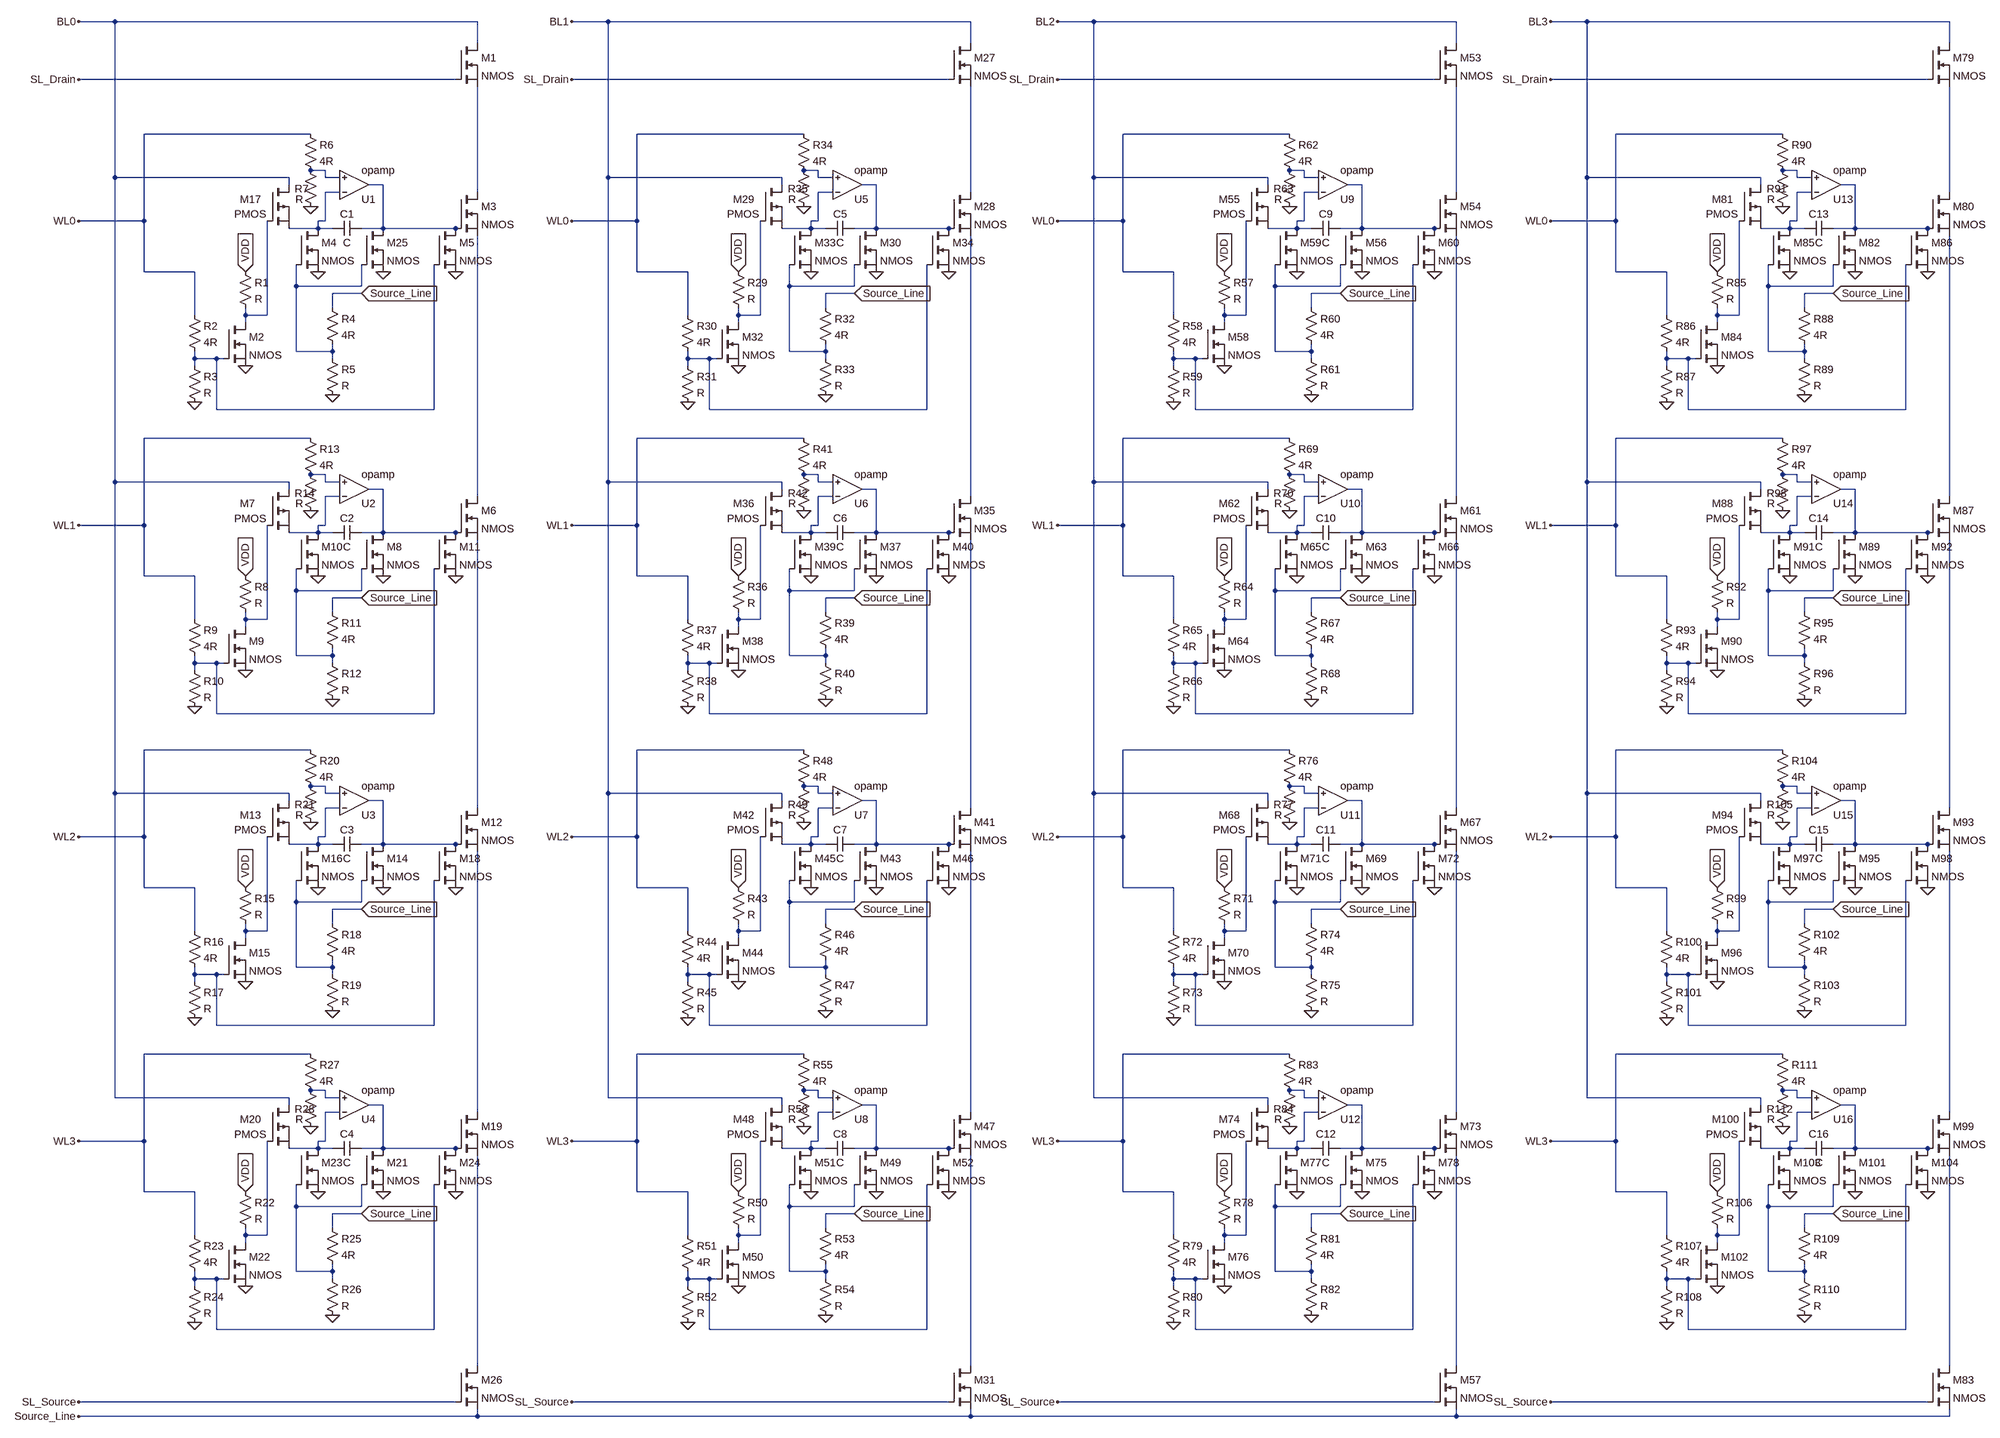
[diagram p0: schematic nand_flash_final.asc]
nand_flash_final.asc, the LTspice schematic file:
Version 4
SHEET 1 2480 2028
WIRE -2272 -1136 -2352 -1136
WIRE -1472 -1136 -2272 -1136
WIRE -1184 -1136 -1264 -1136
WIRE -384 -1136 -1184 -1136
WIRE -112 -1136 -192 -1136
WIRE 688 -1136 -112 -1136
WIRE 976 -1136 896 -1136
WIRE 1776 -1136 976 -1136
WIRE -1472 -1088 -1472 -1136
WIRE -384 -1088 -384 -1136
WIRE 688 -1088 688 -1136
WIRE 1776 -1088 1776 -1136
WIRE -1520 -1008 -2352 -1008
WIRE -432 -1008 -1264 -1008
WIRE 640 -1008 -192 -1008
WIRE 1728 -1008 896 -1008
WIRE -1840 -864 -2208 -864
WIRE -752 -864 -1120 -864
WIRE 320 -864 -48 -864
WIRE 1408 -864 1040 -864
WIRE -1808 -784 -1840 -784
WIRE -720 -784 -752 -784
WIRE 352 -784 320 -784
WIRE 1440 -784 1408 -784
WIRE -2272 -768 -2272 -1136
WIRE -1888 -768 -2272 -768
WIRE -1808 -768 -1808 -784
WIRE -1776 -768 -1808 -768
WIRE -1184 -768 -1184 -1136
WIRE -800 -768 -1184 -768
WIRE -720 -768 -720 -784
WIRE -688 -768 -720 -768
WIRE -112 -768 -112 -1136
WIRE 272 -768 -112 -768
WIRE 352 -768 352 -784
WIRE 384 -768 352 -768
WIRE 976 -768 976 -1136
WIRE 1360 -768 976 -768
WIRE 1440 -768 1440 -784
WIRE 1472 -768 1440 -768
WIRE -1888 -752 -1888 -768
WIRE -1680 -752 -1712 -752
WIRE -800 -752 -800 -768
WIRE -592 -752 -624 -752
WIRE 272 -752 272 -768
WIRE 480 -752 448 -752
WIRE 1360 -752 1360 -768
WIRE 1568 -752 1536 -752
WIRE -1776 -736 -1808 -736
WIRE -1472 -736 -1472 -992
WIRE -688 -736 -720 -736
WIRE -384 -736 -384 -992
WIRE 384 -736 352 -736
WIRE 688 -736 688 -992
WIRE 1472 -736 1440 -736
WIRE 1776 -736 1776 -992
WIRE -2208 -672 -2208 -864
WIRE -2208 -672 -2352 -672
WIRE -1808 -672 -1808 -736
WIRE -1808 -672 -1824 -672
WIRE -1120 -672 -1120 -864
WIRE -1120 -672 -1264 -672
WIRE -720 -672 -720 -736
WIRE -720 -672 -736 -672
WIRE -48 -672 -48 -864
WIRE -48 -672 -192 -672
WIRE 352 -672 352 -736
WIRE 352 -672 336 -672
WIRE 1040 -672 1040 -864
WIRE 1040 -672 896 -672
WIRE 1440 -672 1440 -736
WIRE 1440 -672 1424 -672
WIRE -1824 -656 -1824 -672
WIRE -1824 -656 -1888 -656
WIRE -1792 -656 -1824 -656
WIRE -1680 -656 -1680 -752
WIRE -1680 -656 -1728 -656
WIRE -1520 -656 -1680 -656
WIRE -736 -656 -736 -672
WIRE -736 -656 -800 -656
WIRE -704 -656 -736 -656
WIRE -592 -656 -592 -752
WIRE -592 -656 -640 -656
WIRE -432 -656 -592 -656
WIRE 336 -656 336 -672
WIRE 336 -656 272 -656
WIRE 368 -656 336 -656
WIRE 480 -656 480 -752
WIRE 480 -656 432 -656
WIRE 640 -656 480 -656
WIRE 1424 -656 1424 -672
WIRE 1424 -656 1360 -656
WIRE 1456 -656 1424 -656
WIRE 1568 -656 1568 -752
WIRE 1568 -656 1520 -656
WIRE 1728 -656 1568 -656
WIRE -2208 -560 -2208 -672
WIRE -2096 -560 -2208 -560
WIRE -1120 -560 -1120 -672
WIRE -1008 -560 -1120 -560
WIRE -48 -560 -48 -672
WIRE 64 -560 -48 -560
WIRE 1040 -560 1040 -672
WIRE 1152 -560 1040 -560
WIRE -1872 -528 -1872 -576
WIRE -1728 -528 -1728 -576
WIRE -1728 -528 -1872 -528
WIRE -784 -528 -784 -576
WIRE -640 -528 -640 -576
WIRE -640 -528 -784 -528
WIRE 288 -528 288 -576
WIRE 432 -528 432 -576
WIRE 432 -528 288 -528
WIRE 1376 -528 1376 -576
WIRE 1520 -528 1520 -576
WIRE 1520 -528 1376 -528
WIRE -1728 -512 -1792 -512
WIRE -640 -512 -704 -512
WIRE 432 -512 368 -512
WIRE 1520 -512 1456 -512
WIRE -1792 -480 -1792 -512
WIRE -704 -480 -704 -512
WIRE 368 -480 368 -512
WIRE 1456 -480 1456 -512
WIRE -2096 -464 -2096 -560
WIRE -1984 -464 -1984 -480
WIRE -1936 -464 -1936 -672
WIRE -1936 -464 -1984 -464
WIRE -1008 -464 -1008 -560
WIRE -896 -464 -896 -480
WIRE -848 -464 -848 -672
WIRE -848 -464 -896 -464
WIRE 64 -464 64 -560
WIRE 176 -464 176 -480
WIRE 224 -464 224 -672
WIRE 224 -464 176 -464
WIRE 1152 -464 1152 -560
WIRE 1264 -464 1264 -480
WIRE 1312 -464 1312 -672
WIRE 1312 -464 1264 -464
WIRE -1984 -448 -1984 -464
WIRE -896 -448 -896 -464
WIRE 176 -448 176 -464
WIRE 1264 -448 1264 -464
WIRE -1872 -384 -1872 -528
WIRE -1792 -384 -1792 -400
WIRE -1792 -384 -1872 -384
WIRE -784 -384 -784 -528
WIRE -704 -384 -704 -400
WIRE -704 -384 -784 -384
WIRE 288 -384 288 -528
WIRE 368 -384 368 -400
WIRE 368 -384 288 -384
WIRE 1376 -384 1376 -528
WIRE 1456 -384 1456 -400
WIRE 1456 -384 1376 -384
WIRE -2096 -368 -2096 -384
WIRE -2048 -368 -2096 -368
WIRE -2032 -368 -2048 -368
WIRE -1792 -368 -1792 -384
WIRE -1008 -368 -1008 -384
WIRE -960 -368 -1008 -368
WIRE -944 -368 -960 -368
WIRE -704 -368 -704 -384
WIRE 64 -368 64 -384
WIRE 112 -368 64 -368
WIRE 128 -368 112 -368
WIRE 368 -368 368 -384
WIRE 1152 -368 1152 -384
WIRE 1200 -368 1152 -368
WIRE 1216 -368 1200 -368
WIRE 1456 -368 1456 -384
WIRE -2096 -352 -2096 -368
WIRE -1008 -352 -1008 -368
WIRE 64 -352 64 -368
WIRE 1152 -352 1152 -368
WIRE -2048 -256 -2048 -368
WIRE -1568 -256 -1568 -576
WIRE -1568 -256 -2048 -256
WIRE -960 -256 -960 -368
WIRE -480 -256 -480 -576
WIRE -480 -256 -960 -256
WIRE 112 -256 112 -368
WIRE 592 -256 592 -576
WIRE 592 -256 112 -256
WIRE 1200 -256 1200 -368
WIRE 1680 -256 1680 -576
WIRE 1680 -256 1200 -256
WIRE -1840 -192 -2208 -192
WIRE -752 -192 -1120 -192
WIRE 320 -192 -48 -192
WIRE 1408 -192 1040 -192
WIRE -1808 -112 -1840 -112
WIRE -720 -112 -752 -112
WIRE 352 -112 320 -112
WIRE 1440 -112 1408 -112
WIRE -2272 -96 -2272 -768
WIRE -1888 -96 -2272 -96
WIRE -1808 -96 -1808 -112
WIRE -1776 -96 -1808 -96
WIRE -1184 -96 -1184 -768
WIRE -800 -96 -1184 -96
WIRE -720 -96 -720 -112
WIRE -688 -96 -720 -96
WIRE -112 -96 -112 -768
WIRE 272 -96 -112 -96
WIRE 352 -96 352 -112
WIRE 384 -96 352 -96
WIRE 976 -96 976 -768
WIRE 1360 -96 976 -96
WIRE 1440 -96 1440 -112
WIRE 1472 -96 1440 -96
WIRE -1888 -80 -1888 -96
WIRE -1680 -80 -1712 -80
WIRE -800 -80 -800 -96
WIRE -592 -80 -624 -80
WIRE 272 -80 272 -96
WIRE 480 -80 448 -80
WIRE 1360 -80 1360 -96
WIRE 1568 -80 1536 -80
WIRE -1776 -64 -1808 -64
WIRE -1472 -64 -1472 -640
WIRE -688 -64 -720 -64
WIRE -384 -64 -384 -640
WIRE 384 -64 352 -64
WIRE 688 -64 688 -640
WIRE 1472 -64 1440 -64
WIRE 1776 -64 1776 -640
WIRE -2208 0 -2208 -192
WIRE -2208 0 -2352 0
WIRE -1808 0 -1808 -64
WIRE -1808 0 -1824 0
WIRE -1120 0 -1120 -192
WIRE -1120 0 -1264 0
WIRE -720 0 -720 -64
WIRE -720 0 -736 0
WIRE -48 0 -48 -192
WIRE -48 0 -192 0
WIRE 352 0 352 -64
WIRE 352 0 336 0
WIRE 1040 0 1040 -192
WIRE 1040 0 896 0
WIRE 1440 0 1440 -64
WIRE 1440 0 1424 0
WIRE -1824 16 -1824 0
WIRE -1824 16 -1888 16
WIRE -1792 16 -1824 16
WIRE -1680 16 -1680 -80
WIRE -1680 16 -1728 16
WIRE -1520 16 -1680 16
WIRE -736 16 -736 0
WIRE -736 16 -800 16
WIRE -704 16 -736 16
WIRE -592 16 -592 -80
WIRE -592 16 -640 16
WIRE -432 16 -592 16
WIRE 336 16 336 0
WIRE 336 16 272 16
WIRE 368 16 336 16
WIRE 480 16 480 -80
WIRE 480 16 432 16
WIRE 640 16 480 16
WIRE 1424 16 1424 0
WIRE 1424 16 1360 16
WIRE 1456 16 1424 16
WIRE 1568 16 1568 -80
WIRE 1568 16 1520 16
WIRE 1728 16 1568 16
WIRE -2208 112 -2208 0
WIRE -2096 112 -2208 112
WIRE -1120 112 -1120 0
WIRE -1008 112 -1120 112
WIRE -48 112 -48 0
WIRE 64 112 -48 112
WIRE 1040 112 1040 0
WIRE 1152 112 1040 112
WIRE -1872 144 -1872 96
WIRE -1728 144 -1728 96
WIRE -1728 144 -1872 144
WIRE -784 144 -784 96
WIRE -640 144 -640 96
WIRE -640 144 -784 144
WIRE 288 144 288 96
WIRE 432 144 432 96
WIRE 432 144 288 144
WIRE 1376 144 1376 96
WIRE 1520 144 1520 96
WIRE 1520 144 1376 144
WIRE -1728 160 -1792 160
WIRE -640 160 -704 160
WIRE 432 160 368 160
WIRE 1520 160 1456 160
WIRE -1792 192 -1792 160
WIRE -704 192 -704 160
WIRE 368 192 368 160
WIRE 1456 192 1456 160
WIRE -2096 208 -2096 112
WIRE -1984 208 -1984 192
WIRE -1936 208 -1936 0
WIRE -1936 208 -1984 208
WIRE -1008 208 -1008 112
WIRE -896 208 -896 192
WIRE -848 208 -848 0
WIRE -848 208 -896 208
WIRE 64 208 64 112
WIRE 176 208 176 192
WIRE 224 208 224 0
WIRE 224 208 176 208
WIRE 1152 208 1152 112
WIRE 1264 208 1264 192
WIRE 1312 208 1312 0
WIRE 1312 208 1264 208
WIRE -1984 224 -1984 208
WIRE -896 224 -896 208
WIRE 176 224 176 208
WIRE 1264 224 1264 208
WIRE -1872 288 -1872 144
WIRE -1792 288 -1792 272
WIRE -1792 288 -1872 288
WIRE -784 288 -784 144
WIRE -704 288 -704 272
WIRE -704 288 -784 288
WIRE 288 288 288 144
WIRE 368 288 368 272
WIRE 368 288 288 288
WIRE 1376 288 1376 144
WIRE 1456 288 1456 272
WIRE 1456 288 1376 288
WIRE -2096 304 -2096 288
WIRE -2048 304 -2096 304
WIRE -2032 304 -2048 304
WIRE -1792 304 -1792 288
WIRE -1008 304 -1008 288
WIRE -960 304 -1008 304
WIRE -944 304 -960 304
WIRE -704 304 -704 288
WIRE 64 304 64 288
WIRE 112 304 64 304
WIRE 128 304 112 304
WIRE 368 304 368 288
WIRE 1152 304 1152 288
WIRE 1200 304 1152 304
WIRE 1216 304 1200 304
WIRE 1456 304 1456 288
WIRE -2096 320 -2096 304
WIRE -1008 320 -1008 304
WIRE 64 320 64 304
WIRE 1152 320 1152 304
WIRE -2048 416 -2048 304
WIRE -1568 416 -1568 96
WIRE -1568 416 -2048 416
WIRE -960 416 -960 304
WIRE -480 416 -480 96
WIRE -480 416 -960 416
WIRE 112 416 112 304
WIRE 592 416 592 96
WIRE 592 416 112 416
WIRE 1200 416 1200 304
WIRE 1680 416 1680 96
WIRE 1680 416 1200 416
WIRE -1840 496 -2208 496
WIRE -752 496 -1120 496
WIRE 320 496 -48 496
WIRE 1408 496 1040 496
WIRE -1808 576 -1840 576
WIRE -720 576 -752 576
WIRE 352 576 320 576
WIRE 1440 576 1408 576
WIRE -2272 592 -2272 -96
WIRE -1888 592 -2272 592
WIRE -1808 592 -1808 576
WIRE -1776 592 -1808 592
WIRE -1184 592 -1184 -96
WIRE -800 592 -1184 592
WIRE -720 592 -720 576
WIRE -688 592 -720 592
WIRE -112 592 -112 -96
WIRE 272 592 -112 592
WIRE 352 592 352 576
WIRE 384 592 352 592
WIRE 976 592 976 -96
WIRE 1360 592 976 592
WIRE 1440 592 1440 576
WIRE 1472 592 1440 592
WIRE -1888 608 -1888 592
WIRE -1680 608 -1712 608
WIRE -800 608 -800 592
WIRE -592 608 -624 608
WIRE 272 608 272 592
WIRE 480 608 448 608
WIRE 1360 608 1360 592
WIRE 1568 608 1536 608
WIRE -1776 624 -1808 624
WIRE -1472 624 -1472 32
WIRE -688 624 -720 624
WIRE -384 624 -384 32
WIRE 384 624 352 624
WIRE 688 624 688 32
WIRE 1472 624 1440 624
WIRE 1776 624 1776 32
WIRE -2208 688 -2208 496
WIRE -2208 688 -2352 688
WIRE -1808 688 -1808 624
WIRE -1808 688 -1824 688
WIRE -1120 688 -1120 496
WIRE -1120 688 -1264 688
WIRE -720 688 -720 624
WIRE -720 688 -736 688
WIRE -48 688 -48 496
WIRE -48 688 -192 688
WIRE 352 688 352 624
WIRE 352 688 336 688
WIRE 1040 688 1040 496
WIRE 1040 688 896 688
WIRE 1440 688 1440 624
WIRE 1440 688 1424 688
WIRE -1824 704 -1824 688
WIRE -1824 704 -1888 704
WIRE -1792 704 -1824 704
WIRE -1680 704 -1680 608
WIRE -1680 704 -1728 704
WIRE -1520 704 -1680 704
WIRE -736 704 -736 688
WIRE -736 704 -800 704
WIRE -704 704 -736 704
WIRE -592 704 -592 608
WIRE -592 704 -640 704
WIRE -432 704 -592 704
WIRE 336 704 336 688
WIRE 336 704 272 704
WIRE 368 704 336 704
WIRE 480 704 480 608
WIRE 480 704 432 704
WIRE 640 704 480 704
WIRE 1424 704 1424 688
WIRE 1424 704 1360 704
WIRE 1456 704 1424 704
WIRE 1568 704 1568 608
WIRE 1568 704 1520 704
WIRE 1728 704 1568 704
WIRE -2208 800 -2208 688
WIRE -2096 800 -2208 800
WIRE -1120 800 -1120 688
WIRE -1008 800 -1120 800
WIRE -48 800 -48 688
WIRE 64 800 -48 800
WIRE 1040 800 1040 688
WIRE 1152 800 1040 800
WIRE -1872 832 -1872 784
WIRE -1728 832 -1728 784
WIRE -1728 832 -1872 832
WIRE -784 832 -784 784
WIRE -640 832 -640 784
WIRE -640 832 -784 832
WIRE 288 832 288 784
WIRE 432 832 432 784
WIRE 432 832 288 832
WIRE 1376 832 1376 784
WIRE 1520 832 1520 784
WIRE 1520 832 1376 832
WIRE -1728 848 -1792 848
WIRE -640 848 -704 848
WIRE 432 848 368 848
WIRE 1520 848 1456 848
WIRE -1792 880 -1792 848
WIRE -704 880 -704 848
WIRE 368 880 368 848
WIRE 1456 880 1456 848
WIRE -2096 896 -2096 800
WIRE -1984 896 -1984 880
WIRE -1936 896 -1936 688
WIRE -1936 896 -1984 896
WIRE -1008 896 -1008 800
WIRE -896 896 -896 880
WIRE -848 896 -848 688
WIRE -848 896 -896 896
WIRE 64 896 64 800
WIRE 176 896 176 880
WIRE 224 896 224 688
WIRE 224 896 176 896
WIRE 1152 896 1152 800
WIRE 1264 896 1264 880
WIRE 1312 896 1312 688
WIRE 1312 896 1264 896
WIRE -1984 912 -1984 896
WIRE -896 912 -896 896
WIRE 176 912 176 896
WIRE 1264 912 1264 896
WIRE -1872 976 -1872 832
WIRE -1792 976 -1792 960
WIRE -1792 976 -1872 976
WIRE -784 976 -784 832
WIRE -704 976 -704 960
WIRE -704 976 -784 976
WIRE 288 976 288 832
WIRE 368 976 368 960
WIRE 368 976 288 976
WIRE 1376 976 1376 832
WIRE 1456 976 1456 960
WIRE 1456 976 1376 976
WIRE -2096 992 -2096 976
WIRE -2048 992 -2096 992
WIRE -2032 992 -2048 992
WIRE -1792 992 -1792 976
WIRE -1008 992 -1008 976
WIRE -960 992 -1008 992
WIRE -944 992 -960 992
WIRE -704 992 -704 976
WIRE 64 992 64 976
WIRE 112 992 64 992
WIRE 128 992 112 992
WIRE 368 992 368 976
WIRE 1152 992 1152 976
WIRE 1200 992 1152 992
WIRE 1216 992 1200 992
WIRE 1456 992 1456 976
WIRE -2096 1008 -2096 992
WIRE -1008 1008 -1008 992
WIRE 64 1008 64 992
WIRE 1152 1008 1152 992
WIRE -2048 1104 -2048 992
WIRE -1568 1104 -1568 784
WIRE -1568 1104 -2048 1104
WIRE -960 1104 -960 992
WIRE -480 1104 -480 784
WIRE -480 1104 -960 1104
WIRE 112 1104 112 992
WIRE 592 1104 592 784
WIRE 592 1104 112 1104
WIRE 1200 1104 1200 992
WIRE 1680 1104 1680 784
WIRE 1680 1104 1200 1104
WIRE -1840 1168 -2208 1168
WIRE -752 1168 -1120 1168
WIRE 320 1168 -48 1168
WIRE 1408 1168 1040 1168
WIRE -1808 1248 -1840 1248
WIRE -720 1248 -752 1248
WIRE 352 1248 320 1248
WIRE 1440 1248 1408 1248
WIRE -2272 1264 -2272 592
WIRE -1888 1264 -2272 1264
WIRE -1808 1264 -1808 1248
WIRE -1776 1264 -1808 1264
WIRE -1184 1264 -1184 592
WIRE -800 1264 -1184 1264
WIRE -720 1264 -720 1248
WIRE -688 1264 -720 1264
WIRE -112 1264 -112 592
WIRE 272 1264 -112 1264
WIRE 352 1264 352 1248
WIRE 384 1264 352 1264
WIRE 976 1264 976 592
WIRE 1360 1264 976 1264
WIRE 1440 1264 1440 1248
WIRE 1472 1264 1440 1264
WIRE -1888 1280 -1888 1264
WIRE -1680 1280 -1712 1280
WIRE -800 1280 -800 1264
WIRE -592 1280 -624 1280
WIRE 272 1280 272 1264
WIRE 480 1280 448 1280
WIRE 1360 1280 1360 1264
WIRE 1568 1280 1536 1280
WIRE -1776 1296 -1808 1296
WIRE -1472 1296 -1472 720
WIRE -688 1296 -720 1296
WIRE -384 1296 -384 720
WIRE 384 1296 352 1296
WIRE 688 1296 688 720
WIRE 1472 1296 1440 1296
WIRE 1776 1296 1776 720
WIRE -2208 1360 -2208 1168
WIRE -2208 1360 -2352 1360
WIRE -1808 1360 -1808 1296
WIRE -1808 1360 -1824 1360
WIRE -1120 1360 -1120 1168
WIRE -1120 1360 -1264 1360
WIRE -720 1360 -720 1296
WIRE -720 1360 -736 1360
WIRE -48 1360 -48 1168
WIRE -48 1360 -192 1360
WIRE 352 1360 352 1296
WIRE 352 1360 336 1360
WIRE 1040 1360 1040 1168
WIRE 1040 1360 896 1360
WIRE 1440 1360 1440 1296
WIRE 1440 1360 1424 1360
WIRE -1824 1376 -1824 1360
WIRE -1824 1376 -1888 1376
WIRE -1792 1376 -1824 1376
WIRE -1680 1376 -1680 1280
WIRE -1680 1376 -1728 1376
WIRE -1520 1376 -1680 1376
WIRE -736 1376 -736 1360
WIRE -736 1376 -800 1376
WIRE -704 1376 -736 1376
WIRE -592 1376 -592 1280
WIRE -592 1376 -640 1376
WIRE -432 1376 -592 1376
WIRE 336 1376 336 1360
WIRE 336 1376 272 1376
WIRE 368 1376 336 1376
WIRE 480 1376 480 1280
WIRE 480 1376 432 1376
WIRE 640 1376 480 1376
WIRE 1424 1376 1424 1360
WIRE 1424 1376 1360 1376
WIRE 1456 1376 1424 1376
WIRE 1568 1376 1568 1280
WIRE 1568 1376 1520 1376
WIRE 1728 1376 1568 1376
WIRE -2208 1472 -2208 1360
WIRE -2096 1472 -2208 1472
WIRE -1120 1472 -1120 1360
WIRE -1008 1472 -1120 1472
WIRE -48 1472 -48 1360
WIRE 64 1472 -48 1472
WIRE 1040 1472 1040 1360
WIRE 1152 1472 1040 1472
WIRE -1872 1504 -1872 1456
WIRE -1728 1504 -1728 1456
WIRE -1728 1504 -1872 1504
WIRE -784 1504 -784 1456
WIRE -640 1504 -640 1456
WIRE -640 1504 -784 1504
WIRE 288 1504 288 1456
WIRE 432 1504 432 1456
WIRE 432 1504 288 1504
WIRE 1376 1504 1376 1456
WIRE 1520 1504 1520 1456
WIRE 1520 1504 1376 1504
WIRE -1728 1520 -1792 1520
WIRE -640 1520 -704 1520
WIRE 432 1520 368 1520
WIRE 1520 1520 1456 1520
WIRE -1792 1552 -1792 1520
WIRE -704 1552 -704 1520
WIRE 368 1552 368 1520
WIRE 1456 1552 1456 1520
WIRE -2096 1568 -2096 1472
WIRE -1984 1568 -1984 1552
WIRE -1936 1568 -1936 1360
WIRE -1936 1568 -1984 1568
WIRE -1008 1568 -1008 1472
WIRE -896 1568 -896 1552
WIRE -848 1568 -848 1360
WIRE -848 1568 -896 1568
WIRE 64 1568 64 1472
WIRE 176 1568 176 1552
WIRE 224 1568 224 1360
WIRE 224 1568 176 1568
WIRE 1152 1568 1152 1472
WIRE 1264 1568 1264 1552
WIRE 1312 1568 1312 1360
WIRE 1312 1568 1264 1568
WIRE -1984 1584 -1984 1568
WIRE -896 1584 -896 1568
WIRE 176 1584 176 1568
WIRE 1264 1584 1264 1568
WIRE -1872 1648 -1872 1504
WIRE -1792 1648 -1792 1632
WIRE -1792 1648 -1872 1648
WIRE -784 1648 -784 1504
WIRE -704 1648 -704 1632
WIRE -704 1648 -784 1648
WIRE 288 1648 288 1504
WIRE 368 1648 368 1632
WIRE 368 1648 288 1648
WIRE 1376 1648 1376 1504
WIRE 1456 1648 1456 1632
WIRE 1456 1648 1376 1648
WIRE -2096 1664 -2096 1648
WIRE -2048 1664 -2096 1664
WIRE -2032 1664 -2048 1664
WIRE -1792 1664 -1792 1648
WIRE -1008 1664 -1008 1648
WIRE -960 1664 -1008 1664
WIRE -944 1664 -960 1664
WIRE -704 1664 -704 1648
WIRE 64 1664 64 1648
WIRE 112 1664 64 1664
WIRE 128 1664 112 1664
WIRE 368 1664 368 1648
WIRE 1152 1664 1152 1648
WIRE 1200 1664 1152 1664
WIRE 1216 1664 1200 1664
WIRE 1456 1664 1456 1648
WIRE -2096 1680 -2096 1664
WIRE -1008 1680 -1008 1664
WIRE 64 1680 64 1664
WIRE 1152 1680 1152 1664
WIRE -2048 1776 -2048 1664
WIRE -1568 1776 -1568 1456
WIRE -1568 1776 -2048 1776
WIRE -960 1776 -960 1664
WIRE -480 1776 -480 1456
WIRE -480 1776 -960 1776
WIRE 112 1776 112 1664
WIRE 592 1776 592 1456
WIRE 592 1776 112 1776
WIRE 1200 1776 1200 1664
WIRE 1680 1776 1680 1456
WIRE 1680 1776 1200 1776
WIRE -1472 1856 -1472 1392
WIRE -384 1856 -384 1392
WIRE 688 1856 688 1392
WIRE 1776 1856 1776 1392
WIRE -1520 1936 -2352 1936
WIRE -432 1936 -1264 1936
WIRE 640 1936 -192 1936
WIRE 1728 1936 896 1936
WIRE -1472 1968 -1472 1952
WIRE -1472 1968 -2352 1968
WIRE -384 1968 -384 1952
WIRE -384 1968 -1472 1968
WIRE 688 1968 688 1952
WIRE 688 1968 -384 1968
WIRE 1776 1968 1776 1952
WIRE 1776 1968 688 1968
FLAG -1680 -560 0
FLAG -1984 -560 VDD
IOPIN -1984 -560 In
FLAG -1984 -352 0
FLAG -2096 -272 0
FLAG -1824 -560 0
FLAG -1792 -288 0
FLAG -1840 -704 0
FLAG -1520 -560 0
FLAG -2352 -1136 BL0
FLAG -2352 -672 WL0
FLAG -2352 -1008 SL_Drain
FLAG -2352 1936 SL_Source
FLAG -2352 1968 Source_Line
FLAG -1728 -512 Source_Line
IOPIN -1728 -512 In
FLAG -1680 112 0
FLAG -1984 112 VDD
IOPIN -1984 112 In
FLAG -1984 320 0
FLAG -2096 400 0
FLAG -1824 112 0
FLAG -1792 384 0
FLAG -1840 -32 0
FLAG -1520 112 0
FLAG -2352 0 WL1
FLAG -1728 160 Source_Line
IOPIN -1728 160 In
FLAG -1680 800 0
FLAG -1984 800 VDD
IOPIN -1984 800 In
FLAG -1984 1008 0
FLAG -2096 1088 0
FLAG -1824 800 0
FLAG -1792 1072 0
FLAG -1840 656 0
FLAG -1520 800 0
FLAG -2352 688 WL2
FLAG -1728 848 Source_Line
IOPIN -1728 848 In
FLAG -1680 1472 0
FLAG -1984 1472 VDD
IOPIN -1984 1472 In
FLAG -1984 1680 0
FLAG -2096 1760 0
FLAG -1824 1472 0
FLAG -1792 1744 0
FLAG -1840 1328 0
FLAG -1520 1472 0
FLAG -2352 1360 WL3
FLAG -1728 1520 Source_Line
IOPIN -1728 1520 In
FLAG -592 -560 0
FLAG -896 -560 VDD
IOPIN -896 -560 In
FLAG -896 -352 0
FLAG -1008 -272 0
FLAG -736 -560 0
FLAG -704 -288 0
FLAG -752 -704 0
FLAG -432 -560 0
FLAG -1264 -1136 BL1
FLAG -1264 -672 WL0
FLAG -1264 -1008 SL_Drain
FLAG -1264 1936 SL_Source
FLAG -640 -512 Source_Line
IOPIN -640 -512 In
FLAG -592 112 0
FLAG -896 112 VDD
IOPIN -896 112 In
FLAG -896 320 0
FLAG -1008 400 0
FLAG -736 112 0
FLAG -704 384 0
FLAG -752 -32 0
FLAG -432 112 0
FLAG -1264 0 WL1
FLAG -640 160 Source_Line
IOPIN -640 160 In
FLAG -592 800 0
FLAG -896 800 VDD
IOPIN -896 800 In
FLAG -896 1008 0
FLAG -1008 1088 0
FLAG -736 800 0
FLAG -704 1072 0
FLAG -752 656 0
FLAG -432 800 0
FLAG -1264 688 WL2
FLAG -640 848 Source_Line
IOPIN -640 848 In
FLAG -592 1472 0
FLAG -896 1472 VDD
IOPIN -896 1472 In
FLAG -896 1680 0
FLAG -1008 1760 0
FLAG -736 1472 0
FLAG -704 1744 0
FLAG -752 1328 0
FLAG -432 1472 0
FLAG -1264 1360 WL3
FLAG -640 1520 Source_Line
IOPIN -640 1520 In
FLAG 480 -560 0
FLAG 176 -560 VDD
IOPIN 176 -560 In
FLAG 176 -352 0
FLAG 64 -272 0
FLAG 336 -560 0
FLAG 368 -288 0
FLAG 320 -704 0
FLAG 640 -560 0
FLAG -192 -1136 BL2
FLAG -192 -672 WL0
FLAG -192 -1008 SL_Drain
FLAG -192 1936 SL_Source
FLAG 432 -512 Source_Line
IOPIN 432 -512 In
FLAG 480 112 0
FLAG 176 112 VDD
IOPIN 176 112 In
FLAG 176 320 0
FLAG 64 400 0
FLAG 336 112 0
FLAG 368 384 0
FLAG 320 -32 0
FLAG 640 112 0
FLAG -192 0 WL1
FLAG 432 160 Source_Line
IOPIN 432 160 In
FLAG 480 800 0
FLAG 176 800 VDD
IOPIN 176 800 In
FLAG 176 1008 0
FLAG 64 1088 0
FLAG 336 800 0
FLAG 368 1072 0
FLAG 320 656 0
FLAG 640 800 0
FLAG -192 688 WL2
FLAG 432 848 Source_Line
IOPIN 432 848 In
FLAG 480 1472 0
FLAG 176 1472 VDD
IOPIN 176 1472 In
FLAG 176 1680 0
FLAG 64 1760 0
FLAG 336 1472 0
FLAG 368 1744 0
FLAG 320 1328 0
FLAG 640 1472 0
FLAG -192 1360 WL3
FLAG 432 1520 Source_Line
IOPIN 432 1520 In
FLAG 1568 -560 0
FLAG 1264 -560 VDD
IOPIN 1264 -560 In
FLAG 1264 -352 0
FLAG 1152 -272 0
FLAG 1424 -560 0
FLAG 1456 -288 0
FLAG 1408 -704 0
FLAG 1728 -560 0
FLAG 896 -1136 BL3
FLAG 896 -672 WL0
FLAG 896 -1008 SL_Drain
FLAG 896 1936 SL_Source
FLAG 1520 -512 Source_Line
IOPIN 1520 -512 In
FLAG 1568 112 0
FLAG 1264 112 VDD
IOPIN 1264 112 In
FLAG 1264 320 0
FLAG 1152 400 0
FLAG 1424 112 0
FLAG 1456 384 0
FLAG 1408 -32 0
FLAG 1728 112 0
FLAG 896 0 WL1
FLAG 1520 160 Source_Line
IOPIN 1520 160 In
FLAG 1568 800 0
FLAG 1264 800 VDD
IOPIN 1264 800 In
FLAG 1264 1008 0
FLAG 1152 1088 0
FLAG 1424 800 0
FLAG 1456 1072 0
FLAG 1408 656 0
FLAG 1728 800 0
FLAG 896 688 WL2
FLAG 1520 848 Source_Line
IOPIN 1520 848 In
FLAG 1568 1472 0
FLAG 1264 1472 VDD
IOPIN 1264 1472 In
FLAG 1264 1680 0
FLAG 1152 1760 0
FLAG 1424 1472 0
FLAG 1456 1744 0
FLAG 1408 1328 0
FLAG 1728 1472 0
FLAG 896 1360 WL3
FLAG 1520 1520 Source_Line
IOPIN 1520 1520 In
SYMBOL nmos -1520 -1088 R0
SYMATTR InstName M1
SYMBOL nmos -1520 -736 R0
SYMATTR InstName M3
SYMBOL cap -1728 -672 R90
WINDOW 0 0 32 VBottom 2
WINDOW 3 32 32 VTop 2
SYMATTR InstName C1
SYMBOL pmos -1936 -752 R0
WINDOW 0 -60 32 Left 2
WINDOW 3 -73 65 Left 2
SYMATTR InstName M17
SYMBOL nmos -1728 -656 R0
SYMATTR InstName M25
SYMBOL nmos -1520 1856 R0
SYMATTR InstName M26
SYMBOL res -2000 -576 R0
SYMATTR InstName R1
SYMBOL nmos -2032 -448 R0
SYMATTR InstName M2
SYMBOL res -2112 -480 R0
SYMATTR InstName R2
SYMATTR Value 4R
SYMBOL res -2112 -368 R0
SYMATTR InstName R3
SYMBOL nmos -1872 -656 R0
SYMATTR InstName M4
SYMBOL res -1808 -496 R0
SYMATTR InstName R4
SYMATTR Value 4R
SYMBOL res -1808 -384 R0
SYMATTR InstName R5
SYMBOL OpAmps\\opamp -1744 -688 M180
SYMATTR InstName U1
SYMBOL res -1856 -880 R0
SYMATTR InstName R6
SYMATTR Value 4R
SYMBOL res -1856 -800 R0
WINDOW 0 -19 57 Left 2
WINDOW 3 -18 80 Left 2
SYMATTR InstName R7
SYMBOL nmos -1568 -656 R0
SYMATTR InstName M5
SYMBOL nmos -1520 -64 R0
SYMATTR InstName M6
SYMBOL cap -1728 0 R90
WINDOW 0 0 32 VBottom 2
WINDOW 3 32 32 VTop 2
SYMATTR InstName C2
SYMBOL pmos -1936 -80 R0
WINDOW 0 -60 32 Left 2
WINDOW 3 -73 65 Left 2
SYMATTR InstName M7
SYMBOL nmos -1728 16 R0
SYMATTR InstName M8
SYMBOL res -2000 96 R0
SYMATTR InstName R8
SYMBOL nmos -2032 224 R0
SYMATTR InstName M9
SYMBOL res -2112 192 R0
SYMATTR InstName R9
SYMATTR Value 4R
SYMBOL res -2112 304 R0
SYMATTR InstName R10
SYMBOL nmos -1872 16 R0
SYMATTR InstName M10
SYMBOL res -1808 176 R0
SYMATTR InstName R11
SYMATTR Value 4R
SYMBOL res -1808 288 R0
SYMATTR InstName R12
SYMBOL OpAmps\\opamp -1744 -16 M180
SYMATTR InstName U2
SYMBOL res -1856 -208 R0
SYMATTR InstName R13
SYMATTR Value 4R
SYMBOL res -1856 -128 R0
WINDOW 0 -19 57 Left 2
WINDOW 3 -18 80 Left 2
SYMATTR InstName R14
SYMBOL nmos -1568 16 R0
SYMATTR InstName M11
SYMBOL nmos -1520 624 R0
SYMATTR InstName M12
SYMBOL cap -1728 688 R90
WINDOW 0 0 32 VBottom 2
WINDOW 3 32 32 VTop 2
SYMATTR InstName C3
SYMBOL pmos -1936 608 R0
WINDOW 0 -60 32 Left 2
WINDOW 3 -73 65 Left 2
SYMATTR InstName M13
SYMBOL nmos -1728 704 R0
SYMATTR InstName M14
SYMBOL res -2000 784 R0
SYMATTR InstName R15
SYMBOL nmos -2032 912 R0
SYMATTR InstName M15
SYMBOL res -2112 880 R0
SYMATTR InstName R16
SYMATTR Value 4R
SYMBOL res -2112 992 R0
SYMATTR InstName R17
SYMBOL nmos -1872 704 R0
SYMATTR InstName M16
SYMBOL res -1808 864 R0
SYMATTR InstName R18
SYMATTR Value 4R
SYMBOL res -1808 976 R0
SYMATTR InstName R19
SYMBOL OpAmps\\opamp -1744 672 M180
SYMATTR InstName U3
SYMBOL res -1856 480 R0
SYMATTR InstName R20
SYMATTR Value 4R
SYMBOL res -1856 560 R0
WINDOW 0 -19 57 Left 2
WINDOW 3 -18 80 Left 2
SYMATTR InstName R21
SYMBOL nmos -1568 704 R0
SYMATTR InstName M18
SYMBOL nmos -1520 1296 R0
SYMATTR InstName M19
SYMBOL cap -1728 1360 R90
WINDOW 0 0 32 VBottom 2
WINDOW 3 32 32 VTop 2
SYMATTR InstName C4
SYMBOL pmos -1936 1280 R0
WINDOW 0 -60 32 Left 2
WINDOW 3 -73 65 Left 2
SYMATTR InstName M20
SYMBOL nmos -1728 1376 R0
SYMATTR InstName M21
SYMBOL res -2000 1456 R0
SYMATTR InstName R22
SYMBOL nmos -2032 1584 R0
SYMATTR InstName M22
SYMBOL res -2112 1552 R0
SYMATTR InstName R23
SYMATTR Value 4R
SYMBOL res -2112 1664 R0
SYMATTR InstName R24
SYMBOL nmos -1872 1376 R0
SYMATTR InstName M23
SYMBOL res -1808 1536 R0
SYMATTR InstName R25
SYMATTR Value 4R
SYMBOL res -1808 1648 R0
SYMATTR InstName R26
SYMBOL OpAmps\\opamp -1744 1344 M180
SYMATTR InstName U4
SYMBOL res -1856 1152 R0
SYMATTR InstName R27
SYMATTR Value 4R
SYMBOL res -1856 1232 R0
WINDOW 0 -19 57 Left 2
WINDOW 3 -18 80 Left 2
SYMATTR InstName R28
SYMBOL nmos -1568 1376 R0
SYMATTR InstName M24
SYMBOL nmos -432 -1088 R0
SYMATTR InstName M27
SYMBOL nmos -432 -736 R0
SYMATTR InstName M28
SYMBOL cap -640 -672 R90
WINDOW 0 0 32 VBottom 2
WINDOW 3 32 32 VTop 2
SYMATTR InstName C5
SYMBOL pmos -848 -752 R0
WINDOW 0 -60 32 Left 2
WINDOW 3 -73 65 Left 2
SYMATTR InstName M29
SYMBOL nmos -640 -656 R0
SYMATTR InstName M30
SYMBOL nmos -432 1856 R0
SYMATTR InstName M31
SYMBOL res -912 -576 R0
SYMATTR InstName R29
SYMBOL nmos -944 -448 R0
SYMATTR InstName M32
SYMBOL res -1024 -480 R0
SYMATTR InstName R30
SYMATTR Value 4R
SYMBOL res -1024 -368 R0
SYMATTR InstName R31
SYMBOL nmos -784 -656 R0
SYMATTR InstName M33
SYMBOL res -720 -496 R0
SYMATTR InstName R32
SYMATTR Value 4R
SYMBOL res -720 -384 R0
SYMATTR InstName R33
SYMBOL OpAmps\\opamp -656 -688 M180
SYMATTR InstName U5
SYMBOL res -768 -880 R0
SYMATTR InstName R34
SYMATTR Value 4R
SYMBOL res -768 -800 R0
WINDOW 0 -19 57 Left 2
WINDOW 3 -18 80 Left 2
SYMATTR InstName R35
SYMBOL nmos -480 -656 R0
SYMATTR InstName M34
SYMBOL nmos -432 -64 R0
SYMATTR InstName M35
SYMBOL cap -640 0 R90
WINDOW 0 0 32 VBottom 2
WINDOW 3 32 32 VTop 2
SYMATTR InstName C6
SYMBOL pmos -848 -80 R0
WINDOW 0 -60 32 Left 2
WINDOW 3 -73 65 Left 2
SYMATTR InstName M36
SYMBOL nmos -640 16 R0
SYMATTR InstName M37
SYMBOL res -912 96 R0
SYMATTR InstName R36
SYMBOL nmos -944 224 R0
SYMATTR InstName M38
SYMBOL res -1024 192 R0
SYMATTR InstName R37
SYMATTR Value 4R
SYMBOL res -1024 304 R0
SYMATTR InstName R38
SYMBOL nmos -784 16 R0
SYMATTR InstName M39
SYMBOL res -720 176 R0
SYMATTR InstName R39
SYMATTR Value 4R
SYMBOL res -720 288 R0
SYMATTR InstName R40
SYMBOL OpAmps\\opamp -656 -16 M180
SYMATTR InstName U6
SYMBOL res -768 -208 R0
SYMATTR InstName R41
SYMATTR Value 4R
SYMBOL res -768 -128 R0
WINDOW 0 -19 57 Left 2
WINDOW 3 -18 80 Left 2
SYMATTR InstName R42
SYMBOL nmos -480 16 R0
SYMATTR InstName M40
SYMBOL nmos -432 624 R0
SYMATTR InstName M41
SYMBOL cap -640 688 R90
WINDOW 0 0 32 VBottom 2
WINDOW 3 32 32 VTop 2
SYMATTR InstName C7
SYMBOL pmos -848 608 R0
WINDOW 0 -60 32 Left 2
WINDOW 3 -73 65 Left 2
SYMATTR InstName M42
SYMBOL nmos -640 704 R0
SYMATTR InstName M43
SYMBOL res -912 784 R0
SYMATTR InstName R43
SYMBOL nmos -944 912 R0
SYMATTR InstName M44
SYMBOL res -1024 880 R0
SYMATTR InstName R44
SYMATTR Value 4R
SYMBOL res -1024 992 R0
SYMATTR InstName R45
SYMBOL nmos -784 704 R0
SYMATTR InstName M45
SYMBOL res -720 864 R0
SYMATTR InstName R46
SYMATTR Value 4R
SYMBOL res -720 976 R0
SYMATTR InstName R47
SYMBOL OpAmps\\opamp -656 672 M180
SYMATTR InstName U7
SYMBOL res -768 480 R0
SYMATTR InstName R48
SYMATTR Value 4R
SYMBOL res -768 560 R0
WINDOW 0 -19 57 Left 2
WINDOW 3 -18 80 Left 2
SYMATTR InstName R49
SYMBOL nmos -480 704 R0
SYMATTR InstName M46
SYMBOL nmos -432 1296 R0
SYMATTR InstName M47
SYMBOL cap -640 1360 R90
WINDOW 0 0 32 VBottom 2
WINDOW 3 32 32 VTop 2
SYMATTR InstName C8
SYMBOL pmos -848 1280 R0
WINDOW 0 -60 32 Left 2
WINDOW 3 -73 65 Left 2
SYMATTR InstName M48
SYMBOL nmos -640 1376 R0
SYMATTR InstName M49
SYMBOL res -912 1456 R0
SYMATTR InstName R50
SYMBOL nmos -944 1584 R0
SYMATTR InstName M50
SYMBOL res -1024 1552 R0
SYMATTR InstName R51
SYMATTR Value 4R
SYMBOL res -1024 1664 R0
SYMATTR InstName R52
SYMBOL nmos -784 1376 R0
SYMATTR InstName M51
SYMBOL res -720 1536 R0
SYMATTR InstName R53
SYMATTR Value 4R
SYMBOL res -720 1648 R0
SYMATTR InstName R54
SYMBOL OpAmps\\opamp -656 1344 M180
SYMATTR InstName U8
SYMBOL res -768 1152 R0
SYMATTR InstName R55
SYMATTR Value 4R
SYMBOL res -768 1232 R0
WINDOW 0 -19 57 Left 2
WINDOW 3 -18 80 Left 2
SYMATTR InstName R56
SYMBOL nmos -480 1376 R0
SYMATTR InstName M52
SYMBOL nmos 640 -1088 R0
SYMATTR InstName M53
SYMBOL nmos 640 -736 R0
SYMATTR InstName M54
SYMBOL cap 432 -672 R90
WINDOW 0 0 32 VBottom 2
WINDOW 3 32 32 VTop 2
SYMATTR InstName C9
SYMBOL pmos 224 -752 R0
WINDOW 0 -60 32 Left 2
WINDOW 3 -73 65 Left 2
SYMATTR InstName M55
SYMBOL nmos 432 -656 R0
SYMATTR InstName M56
SYMBOL nmos 640 1856 R0
SYMATTR InstName M57
SYMBOL res 160 -576 R0
SYMATTR InstName R57
SYMBOL nmos 128 -448 R0
SYMATTR InstName M58
SYMBOL res 48 -480 R0
SYMATTR InstName R58
SYMATTR Value 4R
SYMBOL res 48 -368 R0
SYMATTR InstName R59
SYMBOL nmos 288 -656 R0
SYMATTR InstName M59
SYMBOL res 352 -496 R0
SYMATTR InstName R60
SYMATTR Value 4R
SYMBOL res 352 -384 R0
SYMATTR InstName R61
SYMBOL OpAmps\\opamp 416 -688 M180
SYMATTR InstName U9
SYMBOL res 304 -880 R0
SYMATTR InstName R62
SYMATTR Value 4R
SYMBOL res 304 -800 R0
WINDOW 0 -19 57 Left 2
WINDOW 3 -18 80 Left 2
SYMATTR InstName R63
SYMBOL nmos 592 -656 R0
SYMATTR InstName M60
SYMBOL nmos 640 -64 R0
SYMATTR InstName M61
SYMBOL cap 432 0 R90
WINDOW 0 0 32 VBottom 2
WINDOW 3 32 32 VTop 2
SYMATTR InstName C10
SYMBOL pmos 224 -80 R0
WINDOW 0 -60 32 Left 2
WINDOW 3 -73 65 Left 2
SYMATTR InstName M62
SYMBOL nmos 432 16 R0
SYMATTR InstName M63
SYMBOL res 160 96 R0
SYMATTR InstName R64
SYMBOL nmos 128 224 R0
SYMATTR InstName M64
SYMBOL res 48 192 R0
SYMATTR InstName R65
SYMATTR Value 4R
SYMBOL res 48 304 R0
SYMATTR InstName R66
SYMBOL nmos 288 16 R0
SYMATTR InstName M65
SYMBOL res 352 176 R0
SYMATTR InstName R67
SYMATTR Value 4R
SYMBOL res 352 288 R0
SYMATTR InstName R68
SYMBOL OpAmps\\opamp 416 -16 M180
SYMATTR InstName U10
SYMBOL res 304 -208 R0
SYMATTR InstName R69
SYMATTR Value 4R
SYMBOL res 304 -128 R0
WINDOW 0 -19 57 Left 2
WINDOW 3 -18 80 Left 2
SYMATTR InstName R70
SYMBOL nmos 592 16 R0
SYMATTR InstName M66
SYMBOL nmos 640 624 R0
SYMATTR InstName M67
SYMBOL cap 432 688 R90
WINDOW 0 0 32 VBottom 2
WINDOW 3 32 32 VTop 2
SYMATTR InstName C11
SYMBOL pmos 224 608 R0
WINDOW 0 -60 32 Left 2
WINDOW 3 -73 65 Left 2
SYMATTR InstName M68
SYMBOL nmos 432 704 R0
SYMATTR InstName M69
SYMBOL res 160 784 R0
SYMATTR InstName R71
SYMBOL nmos 128 912 R0
SYMATTR InstName M70
SYMBOL res 48 880 R0
SYMATTR InstName R72
SYMATTR Value 4R
SYMBOL res 48 992 R0
SYMATTR InstName R73
SYMBOL nmos 288 704 R0
SYMATTR InstName M71
SYMBOL res 352 864 R0
SYMATTR InstName R74
SYMATTR Value 4R
SYMBOL res 352 976 R0
SYMATTR InstName R75
SYMBOL OpAmps\\opamp 416 672 M180
SYMATTR InstName U11
SYMBOL res 304 480 R0
SYMATTR InstName R76
SYMATTR Value 4R
SYMBOL res 304 560 R0
WINDOW 0 -19 57 Left 2
WINDOW 3 -18 80 Left 2
SYMATTR InstName R77
SYMBOL nmos 592 704 R0
SYMATTR InstName M72
SYMBOL nmos 640 1296 R0
SYMATTR InstName M73
SYMBOL cap 432 1360 R90
WINDOW 0 0 32 VBottom 2
WINDOW 3 32 32 VTop 2
SYMATTR InstName C12
SYMBOL pmos 224 1280 R0
WINDOW 0 -60 32 Left 2
WINDOW 3 -73 65 Left 2
SYMATTR InstName M74
SYMBOL nmos 432 1376 R0
SYMATTR InstName M75
SYMBOL res 160 1456 R0
SYMATTR InstName R78
SYMBOL nmos 128 1584 R0
SYMATTR InstName M76
SYMBOL res 48 1552 R0
SYMATTR InstName R79
SYMATTR Value 4R
SYMBOL res 48 1664 R0
SYMATTR InstName R80
SYMBOL nmos 288 1376 R0
SYMATTR InstName M77
SYMBOL res 352 1536 R0
SYMATTR InstName R81
SYMATTR Value 4R
SYMBOL res 352 1648 R0
SYMATTR InstName R82
SYMBOL OpAmps\\opamp 416 1344 M180
SYMATTR InstName U12
SYMBOL res 304 1152 R0
SYMATTR InstName R83
SYMATTR Value 4R
SYMBOL res 304 1232 R0
WINDOW 0 -19 57 Left 2
WINDOW 3 -18 80 Left 2
SYMATTR InstName R84
SYMBOL nmos 592 1376 R0
SYMATTR InstName M78
SYMBOL nmos 1728 -1088 R0
SYMATTR InstName M79
SYMBOL nmos 1728 -736 R0
SYMATTR InstName M80
SYMBOL cap 1520 -672 R90
WINDOW 0 0 32 VBottom 2
WINDOW 3 32 32 VTop 2
SYMATTR InstName C13
SYMBOL pmos 1312 -752 R0
WINDOW 0 -60 32 Left 2
WINDOW 3 -73 65 Left 2
SYMATTR InstName M81
SYMBOL nmos 1520 -656 R0
SYMATTR InstName M82
SYMBOL nmos 1728 1856 R0
SYMATTR InstName M83
SYMBOL res 1248 -576 R0
SYMATTR InstName R85
SYMBOL nmos 1216 -448 R0
SYMATTR InstName M84
SYMBOL res 1136 -480 R0
SYMATTR InstName R86
SYMATTR Value 4R
SYMBOL res 1136 -368 R0
SYMATTR InstName R87
SYMBOL nmos 1376 -656 R0
SYMATTR InstName M85
SYMBOL res 1440 -496 R0
SYMATTR InstName R88
SYMATTR Value 4R
SYMBOL res 1440 -384 R0
SYMATTR InstName R89
SYMBOL OpAmps\\opamp 1504 -688 M180
SYMATTR InstName U13
SYMBOL res 1392 -880 R0
SYMATTR InstName R90
SYMATTR Value 4R
SYMBOL res 1392 -800 R0
WINDOW 0 -19 57 Left 2
WINDOW 3 -18 80 Left 2
SYMATTR InstName R91
SYMBOL nmos 1680 -656 R0
SYMATTR InstName M86
SYMBOL nmos 1728 -64 R0
SYMATTR InstName M87
SYMBOL cap 1520 0 R90
WINDOW 0 0 32 VBottom 2
WINDOW 3 32 32 VTop 2
SYMATTR InstName C14
SYMBOL pmos 1312 -80 R0
WINDOW 0 -60 32 Left 2
WINDOW 3 -73 65 Left 2
SYMATTR InstName M88
SYMBOL nmos 1520 16 R0
SYMATTR InstName M89
SYMBOL res 1248 96 R0
SYMATTR InstName R92
SYMBOL nmos 1216 224 R0
SYMATTR InstName M90
SYMBOL res 1136 192 R0
SYMATTR InstName R93
SYMATTR Value 4R
SYMBOL res 1136 304 R0
SYMATTR InstName R94
SYMBOL nmos 1376 16 R0
SYMATTR InstName M91
SYMBOL res 1440 176 R0
SYMATTR InstName R95
SYMATTR Value 4R
SYMBOL res 1440 288 R0
SYMATTR InstName R96
SYMBOL OpAmps\\opamp 1504 -16 M180
SYMATTR InstName U14
SYMBOL res 1392 -208 R0
SYMATTR InstName R97
SYMATTR Value 4R
SYMBOL res 1392 -128 R0
WINDOW 0 -19 57 Left 2
WINDOW 3 -18 80 Left 2
SYMATTR InstName R98
SYMBOL nmos 1680 16 R0
SYMATTR InstName M92
SYMBOL nmos 1728 624 R0
SYMATTR InstName M93
SYMBOL cap 1520 688 R90
WINDOW 0 0 32 VBottom 2
WINDOW 3 32 32 VTop 2
SYMATTR InstName C15
SYMBOL pmos 1312 608 R0
WINDOW 0 -60 32 Left 2
WINDOW 3 -73 65 Left 2
SYMATTR InstName M94
SYMBOL nmos 1520 704 R0
SYMATTR InstName M95
SYMBOL res 1248 784 R0
SYMATTR InstName R99
SYMBOL nmos 1216 912 R0
SYMATTR InstName M96
SYMBOL res 1136 880 R0
SYMATTR InstName R100
SYMATTR Value 4R
SYMBOL res 1136 992 R0
SYMATTR InstName R101
SYMBOL nmos 1376 704 R0
SYMATTR InstName M97
SYMBOL res 1440 864 R0
SYMATTR InstName R102
SYMATTR Value 4R
SYMBOL res 1440 976 R0
SYMATTR InstName R103
SYMBOL OpAmps\\opamp 1504 672 M180
SYMATTR InstName U15
SYMBOL res 1392 480 R0
SYMATTR InstName R104
SYMATTR Value 4R
SYMBOL res 1392 560 R0
WINDOW 0 -19 57 Left 2
WINDOW 3 -18 80 Left 2
SYMATTR InstName R105
SYMBOL nmos 1680 704 R0
SYMATTR InstName M98
SYMBOL nmos 1728 1296 R0
SYMATTR InstName M99
SYMBOL cap 1520 1360 R90
WINDOW 0 0 32 VBottom 2
WINDOW 3 32 32 VTop 2
SYMATTR InstName C16
SYMBOL pmos 1312 1280 R0
WINDOW 0 -60 32 Left 2
WINDOW 3 -73 65 Left 2
SYMATTR InstName M100
SYMBOL nmos 1520 1376 R0
SYMATTR InstName M101
SYMBOL res 1248 1456 R0
SYMATTR InstName R106
SYMBOL nmos 1216 1584 R0
SYMATTR InstName M102
SYMBOL res 1136 1552 R0
SYMATTR InstName R107
SYMATTR Value 4R
SYMBOL res 1136 1664 R0
SYMATTR InstName R108
SYMBOL nmos 1376 1376 R0
SYMATTR InstName M103
SYMBOL res 1440 1536 R0
SYMATTR InstName R109
SYMATTR Value 4R
SYMBOL res 1440 1648 R0
SYMATTR InstName R110
SYMBOL OpAmps\\opamp 1504 1344 M180
SYMATTR InstName U16
SYMBOL res 1392 1152 R0
SYMATTR InstName R111
SYMATTR Value 4R
SYMBOL res 1392 1232 R0
WINDOW 0 -19 57 Left 2
WINDOW 3 -18 80 Left 2
SYMATTR InstName R112
SYMBOL nmos 1680 1376 R0
SYMATTR InstName M104

The netlist it stands for:
* nand_flash_final.asc
M1 BL0 SL_Drain N010 N010 NMOS
M3 N010 N005 N038 N038 NMOS
C1 N005 N009 C
M17 BL0 N021 N009 N009 PMOS
M25 N005 N017 0 0 NMOS
M26 N113 SL_Source Source_Line Source_Line NMOS
R1 VDD N021 R
M2 N021 N025 0 0 NMOS
R2 WL0 N025 4R
R3 N025 0 R
M4 N009 N017 0 0 NMOS
R4 Source_Line N017 4R
R5 N017 0 R
XU1 N009 N001 N005 opamp Aol=100K GBW=10Meg  ; pins invin noninvin out
R6 WL0 N001 4R
R7 N001 0 R
M5 N005 N025 0 0 NMOS
M6 N038 N033 N066 N066 NMOS
C2 N033 N037 C
M7 BL0 N049 N037 N037 PMOS
M8 N033 N045 0 0 NMOS
R8 VDD N049 R
M9 N049 N053 0 0 NMOS
R9 WL1 N053 4R
R10 N053 0 R
M10 N037 N045 0 0 NMOS
R11 Source_Line N045 4R
R12 N045 0 R
XU2 N037 N029 N033 opamp Aol=100K GBW=10Meg  ; pins invin noninvin out
R13 WL1 N029 4R
R14 N029 0 R
M11 N033 N053 0 0 NMOS
M12 N066 N061 N094 N094 NMOS
C3 N061 N065 C
M13 BL0 N077 N065 N065 PMOS
M14 N061 N073 0 0 NMOS
R15 VDD N077 R
M15 N077 N081 0 0 NMOS
R16 WL2 N081 4R
R17 N081 0 R
M16 N065 N073 0 0 NMOS
R18 Source_Line N073 4R
R19 N073 0 R
XU3 N065 N057 N061 opamp Aol=100K GBW=10Meg  ; pins invin noninvin out
R20 WL2 N057 4R
R21 N057 0 R
M18 N061 N081 0 0 NMOS
M19 N094 N089 N113 N113 NMOS
C4 N089 N093 C
M20 BL0 N105 N093 N093 PMOS
M21 N089 N101 0 0 NMOS
R22 VDD N105 R
M22 N105 N109 0 0 NMOS
R23 WL3 N109 4R
R24 N109 0 R
M23 N093 N101 0 0 NMOS
R25 Source_Line N101 4R
R26 N101 0 R
XU4 N093 N085 N089 opamp Aol=100K GBW=10Meg  ; pins invin noninvin out
R27 WL3 N085 4R
R28 N085 0 R
M24 N089 N109 0 0 NMOS
M27 BL1 SL_Drain N012 N012 NMOS
M28 N012 N006 N040 N040 NMOS
C5 N006 N011 C
M29 BL1 N022 N011 N011 PMOS
M30 N006 N018 0 0 NMOS
M31 N114 SL_Source Source_Line Source_Line NMOS
R29 VDD N022 R
M32 N022 N026 0 0 NMOS
R30 WL0 N026 4R
R31 N026 0 R
M33 N011 N018 0 0 NMOS
R32 Source_Line N018 4R
R33 N018 0 R
XU5 N011 N002 N006 opamp Aol=100K GBW=10Meg  ; pins invin noninvin out
R34 WL0 N002 4R
R35 N002 0 R
M34 N006 N026 0 0 NMOS
M35 N040 N034 N068 N068 NMOS
C6 N034 N039 C
M36 BL1 N050 N039 N039 PMOS
M37 N034 N046 0 0 NMOS
R36 VDD N050 R
M38 N050 N054 0 0 NMOS
R37 WL1 N054 4R
R38 N054 0 R
M39 N039 N046 0 0 NMOS
R39 Source_Line N046 4R
R40 N046 0 R
XU6 N039 N030 N034 opamp Aol=100K GBW=10Meg  ; pins invin noninvin out
R41 WL1 N030 4R
R42 N030 0 R
M40 N034 N054 0 0 NMOS
M41 N068 N062 N096 N096 NMOS
C7 N062 N067 C
M42 BL1 N078 N067 N067 PMOS
M43 N062 N074 0 0 NMOS
R43 VDD N078 R
M44 N078 N082 0 0 NMOS
R44 WL2 N082 4R
R45 N082 0 R
M45 N067 N074 0 0 NMOS
R46 Source_Line N074 4R
R47 N074 0 R
XU7 N067 N058 N062 opamp Aol=100K GBW=10Meg  ; pins invin noninvin out
R48 WL2 N058 4R
R49 N058 0 R
M46 N062 N082 0 0 NMOS
M47 N096 N090 N114 N114 NMOS
C8 N090 N095 C
M48 BL1 N106 N095 N095 PMOS
M49 N090 N102 0 0 NMOS
R50 VDD N106 R
M50 N106 N110 0 0 NMOS
R51 WL3 N110 4R
R52 N110 0 R
M51 N095 N102 0 0 NMOS
R53 Source_Line N102 4R
R54 N102 0 R
XU8 N095 N086 N090 opamp Aol=100K GBW=10Meg  ; pins invin noninvin out
R55 WL3 N086 4R
R56 N086 0 R
M52 N090 N110 0 0 NMOS
M53 BL2 SL_Drain N014 N014 NMOS
M54 N014 N007 N042 N042 NMOS
C9 N007 N013 C
M55 BL2 N023 N013 N013 PMOS
M56 N007 N019 0 0 NMOS
M57 N115 SL_Source Source_Line Source_Line NMOS
R57 VDD N023 R
M58 N023 N027 0 0 NMOS
R58 WL0 N027 4R
R59 N027 0 R
M59 N013 N019 0 0 NMOS
R60 Source_Line N019 4R
R61 N019 0 R
XU9 N013 N003 N007 opamp Aol=100K GBW=10Meg  ; pins invin noninvin out
R62 WL0 N003 4R
R63 N003 0 R
M60 N007 N027 0 0 NMOS
M61 N042 N035 N070 N070 NMOS
C10 N035 N041 C
M62 BL2 N051 N041 N041 PMOS
M63 N035 N047 0 0 NMOS
R64 VDD N051 R
M64 N051 N055 0 0 NMOS
R65 WL1 N055 4R
R66 N055 0 R
M65 N041 N047 0 0 NMOS
R67 Source_Line N047 4R
R68 N047 0 R
XU10 N041 N031 N035 opamp Aol=100K GBW=10Meg  ; pins invin noninvin out
R69 WL1 N031 4R
R70 N031 0 R
M66 N035 N055 0 0 NMOS
M67 N070 N063 N098 N098 NMOS
C11 N063 N069 C
M68 BL2 N079 N069 N069 PMOS
M69 N063 N075 0 0 NMOS
R71 VDD N079 R
M70 N079 N083 0 0 NMOS
R72 WL2 N083 4R
R73 N083 0 R
M71 N069 N075 0 0 NMOS
R74 Source_Line N075 4R
R75 N075 0 R
XU11 N069 N059 N063 opamp Aol=100K GBW=10Meg  ; pins invin noninvin out
R76 WL2 N059 4R
R77 N059 0 R
M72 N063 N083 0 0 NMOS
M73 N098 N091 N115 N115 NMOS
C12 N091 N097 C
M74 BL2 N107 N097 N097 PMOS
M75 N091 N103 0 0 NMOS
R78 VDD N107 R
M76 N107 N111 0 0 NMOS
R79 WL3 N111 4R
R80 N111 0 R
M77 N097 N103 0 0 NMOS
R81 Source_Line N103 4R
R82 N103 0 R
XU12 N097 N087 N091 opamp Aol=100K GBW=10Meg  ; pins invin noninvin out
R83 WL3 N087 4R
R84 N087 0 R
M78 N091 N111 0 0 NMOS
M79 BL3 SL_Drain N016 N016 NMOS
M80 N016 N008 N044 N044 NMOS
C13 N008 N015 C
M81 BL3 N024 N015 N015 PMOS
M82 N008 N020 0 0 NMOS
M83 N116 SL_Source Source_Line Source_Line NMOS
R85 VDD N024 R
M84 N024 N028 0 0 NMOS
R86 WL0 N028 4R
R87 N028 0 R
M85 N015 N020 0 0 NMOS
R88 Source_Line N020 4R
R89 N020 0 R
XU13 N015 N004 N008 opamp Aol=100K GBW=10Meg  ; pins invin noninvin out
R90 WL0 N004 4R
R91 N004 0 R
M86 N008 N028 0 0 NMOS
M87 N044 N036 N072 N072 NMOS
C14 N036 N043 C
M88 BL3 N052 N043 N043 PMOS
M89 N036 N048 0 0 NMOS
R92 VDD N052 R
M90 N052 N056 0 0 NMOS
R93 WL1 N056 4R
R94 N056 0 R
M91 N043 N048 0 0 NMOS
R95 Source_Line N048 4R
R96 N048 0 R
XU14 N043 N032 N036 opamp Aol=100K GBW=10Meg  ; pins invin noninvin out
R97 WL1 N032 4R
R98 N032 0 R
M92 N036 N056 0 0 NMOS
M93 N072 N064 N100 N100 NMOS
C15 N064 N071 C
M94 BL3 N080 N071 N071 PMOS
M95 N064 N076 0 0 NMOS
R99 VDD N080 R
M96 N080 N084 0 0 NMOS
R100 WL2 N084 4R
R101 N084 0 R
M97 N071 N076 0 0 NMOS
R102 Source_Line N076 4R
R103 N076 0 R
XU15 N071 N060 N064 opamp Aol=100K GBW=10Meg  ; pins invin noninvin out
R104 WL2 N060 4R
R105 N060 0 R
M98 N064 N084 0 0 NMOS
M99 N100 N092 N116 N116 NMOS
C16 N092 N099 C
M100 BL3 N108 N099 N099 PMOS
M101 N092 N104 0 0 NMOS
R106 VDD N108 R
M102 N108 N112 0 0 NMOS
R107 WL3 N112 4R
R108 N112 0 R
M103 N099 N104 0 0 NMOS
R109 Source_Line N104 4R
R110 N104 0 R
XU16 N099 N088 N092 opamp Aol=100K GBW=10Meg  ; pins invin noninvin out
R111 WL3 N088 4R
R112 N088 0 R
M104 N092 N112 0 0 NMOS
.model NMOS NMOS
.model PMOS PMOS
.lib standard.mos
.backanno
.end